# Altium schematic sheet Smartfin Main PCBA Control.SchDoc: Control
size Letter; TOCFontName: Consolas; TOCFontSize: 24; TOCFontColor: 0; TOCFontAttributes: 0; TOCMaxLinesInTable: 25; TOCVerticalOffset: 200; TOCHorizontalOffset: 500; TOCHorizontalSeparation: 800; TOCVerticalSeparation: 30; TOCHorizTableSize: 640; Engineer: Amy Domino; DocumentNumber: 644-001-023; Revision: A; SheetNumber: 3; SheetTotal: 8; PageSetup: Record=PageOptions|CenterHorizontal=True|CenterVertical=True|PrintScale=0.96|XCorrection=1.00|YCorrection=1.00|PrintKind=0|BorderSize=5000000|LeftOffset=0|BottomOffset=0|Orientation=2|PaperLength=1000|PaperWidth=1000|Scale=100|PaperSource=7|PrintQuality=-4|MediaType=1|DitherType=10|PaperKind=11" x 17"|PrintScaleMode=1
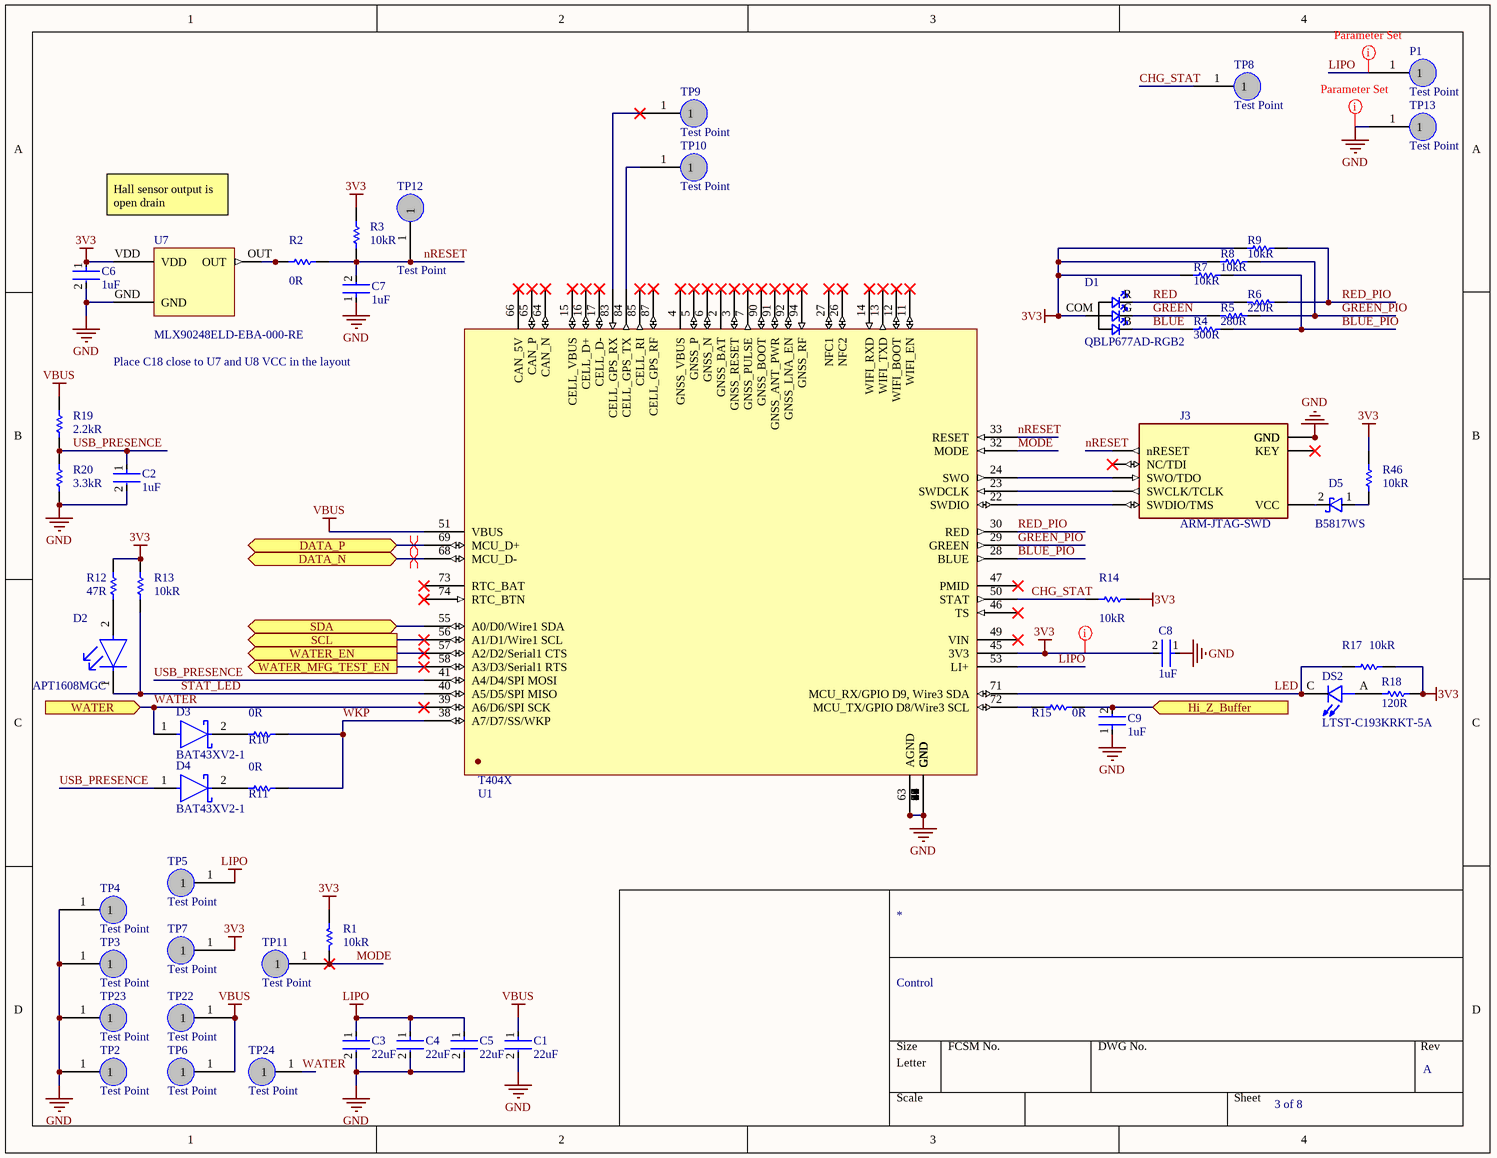
[diagram p0: Smartfin Main PCBA Control.SchDoc]

## Parts
C1  value 22uF  [FP-CC0603-DC-IPC_B]  (hidden comment: CC0603MRX5R5BB226)
C2  value 1uF  [FP-CC0402-IPC_C]  (hidden comment: cc0402krx5r6bb105)
C3  value 22uF  [FP-CC0603-DC-IPC_B]  (hidden comment: CC0603MRX5R5BB226)
C4  value 22uF  [FP-CC0603-DC-IPC_B]  (hidden comment: CC0603MRX5R5BB226)
C5  value 22uF  [FP-CC0603-DC-IPC_B]  (hidden comment: CC0603MRX5R5BB226)
C6  value 1uF  [FP-CC0402-IPC_C]  (hidden comment: cc0402krx5r6bb105)
C7  value 1uF  [FP-CC0402-IPC_C]  (hidden comment: cc0402krx5r6bb105)
C8  value 1uF  [FP-CC0402-IPC_C]  (hidden comment: cc0402krx5r6bb105)
C9  value 1uF  [FP-CC0402-IPC_C]  (hidden comment: cc0402krx5r6bb105)
D1  QBLP677AD-RGB2  [New footprint 1]
D2  APT1608MGC  [SODFL160X75-2N]
D3  BAT43XV2-1  [SODFL250X75-2N]
D4  BAT43XV2-1  [SODFL250X75-2N]
D5  B5817WS  [SODFL250X135-2N]
DS2  LTST-C193KRKT-5A  [LEDC1608X45N]
J3  ARM-JTAG-SWD  [ARM-JTAG-10-SWD-IDC]
P1  Test Point  [New footprint 1]
R1  value 10kR  [RESC1005X04N]  (hidden comment: RC0402FR-0710KL)
R2  value 0R  [RESC1005X04N]  (hidden comment: RC0402JR-070RL)
R3  value 10kR  [RESC1005X04N]  (hidden comment: RC0402FR-0710KL)
R4  value 300R  [RESC1005X04N]  (hidden comment: RC0402FR-07300RL)
R5  value 280R  [RESC1005X04N]  (hidden comment: RC0402FR-07280RL)
R6  value 220R  [RESC1005X04N]  (hidden comment: RC0402FR-07220R)
R7  value 10kR  [RESC1005X04N]  (hidden comment: RC0402FR-0710KL)
R8  value 10kR  [RESC1005X04N]  (hidden comment: RC0402FR-0710KL)
R9  value 10kR  [RESC1005X04N]  (hidden comment: RC0402FR-0710KL)
R10  value 0R  [RESC1005X04N]  (hidden comment: RC0402JR-070RL)
R11  value 0R  [RESC1005X04N]  (hidden comment: RC0402JR-070RL)
R12  47R  [RESC1005X40X25LL05T10]
R13  value 10kR  [RESC1005X04N]  (hidden comment: RC0402FR-0710KL)
R14  value 10kR  [RESC1005X04N]  (hidden comment: RC0402FR-0710KL)
R15  value 0R  [RESC1005X04N]  (hidden comment: RC0402JR-070RL)
R17  value 10kR  [RESC1005X04N]  (hidden comment: RC0402FR-0710KL)
R18  value 120R  [RESC1005X04N]  (hidden comment: RC0402FR-07120RL)
R19  value 2.2kR  [RESC1005X04N]  (hidden comment: RC0402FR-072K2L)
R20  value 3.3kR  [RESC1005X04N]  (hidden comment: RC0402FR-073K3L)
R46  value 10kR  [RESC1005X04N]  (hidden comment: RC0402FR-0710KL)
TP2  Test Point  [New footprint 1]
TP3  Test Point  [New footprint 1]
TP4  Test Point  [New footprint 1]
TP5  Test Point  [New footprint 1]
TP6  Test Point  [New footprint 1]
TP7  Test Point  [New footprint 1]
TP8  Test Point  [New footprint 1]
TP9  Test Point  [New footprint 1]
TP10  Test Point  [New footprint 1]
TP11  Test Point  [New footprint 1]
TP12  Test Point  [New footprint 1]
TP13  Test Point  [New footprint 1]
TP22  Test Point  [New footprint 1]
TP23  Test Point  [New footprint 1]
TP24  Test Point  [New footprint 1]
U1  T404X  [New footprint 1]
U7  MLX90248ELD-EBA-000-RE  [SON50P150X40_HS-7N]

## Ports
DATA_N (bidir), DATA_P (bidir), Hi_Z_Buffer (in), SCL (out), SDA (bidir), WATER (in), WATER_EN (out), WATER_MFG_TEST_EN (out)

## Nets
3V3: C6.1 C8.2 D1.COM R1.2 R3.2 R7.2 R8.2 R9.2 R12.2 R13.2 R14.2 R17.2 R18.2 R46.1 TP7.1 U1.45(3V3) U7.VDD
GND: C1.2 C2.2 C3.2 C4.2 C5.2 C6.2 C7.1 C8.1 C9.1 J3.GND@1(GND) J3.GND@2(GND) J3.GND@3(GND) R20.1 TP2.1 TP3.1 TP4.1 TP13.1 TP23.1 U1.1(GND) U1.8(GND) U1.10(GND) U1.25(GND) U1.31(GND) U1.42(GND) U1.43(GND) U1.48(GND) U1.52(GND) U1.54(GND) U1.63(AGND) U1.67(GND) U1.70(GND) U1.75(GND) U1.86(GND) U1.88(GND) U1.89(GND) U1.93(GND) U1.95(GND) U7.GND
LIPO: C3.1 C4.1 C5.1 P1.1 TP5.1 U1.53(LI+)
VBUS: C1.1 R19.1 TP6.1 TP22.1 U1.51(VBUS)
BLUE: D1.B R4.2
BLUE_PIO: R4.1 R7.1 U1.28(BLUE)
CHG_STAT: R14.1 TP8.1 U1.50(STAT)
DATA_N: U1.68(MCU_D-) ; port DATA_N
DATA_P: U1.69(MCU_D+) ; port DATA_P
GREEN: D1.G R5.2
GREEN_PIO: R5.1 R8.1 U1.29(GREEN)
Hi_Z_Buffer: C9.2 R15.2 ; port Hi_Z_Buffer
LED: DS2.C R17.1 U1.71(MCU_RX/GPIO_D9,_Wire3_SDA)
MODE: R1.1 TP11.1 U1.32(MODE)
nRESET: C7.2 J3.nRESET R2.2 R3.1 TP12.1 U1.33(RESET)
RED: D1.R R6.2
RED_PIO: R6.1 R9.1 U1.30(RED)
SCL: U1.56(A1/D1/Wire1_SCL) ; port SCL
SDA: U1.55(A0/D0/Wire1_SDA) ; port SDA
STAT_LED: D2.1(C) R13.1 U1.40(A5/D5/SPI_MISO)
USB_PRESENCE: C2.1 D4.1(C) R19.2 R20.2 U1.41(A4/D4/SPI_MOSI)
WATER: D3.1(C) TP24.1 U1.39(A6/D6/SPI_SCK) ; port WATER
WATER_EN: U1.57(A2/D2/Serial1_CTS) ; port WATER_EN
WATER_MFG_TEST_EN: U1.58(A3/D3/Serial1_RTS) ; port WATER_MFG_TEST_EN
WKP: R10.2 R11.2 U1.38(A7/D7/SS/WKP)
NetD2_2: D2.2(A) R12.1
NetD3_2: D3.2(A) R10.1
NetD4_2: D4.2(A) R11.1
NetD5_1: D5.1 R46.2
NetD5_2: D5.2 J3.VCC
NetDS2_A: DS2.A R18.1
NetJ3_TCK: J3.TCK(SWCLK/TCLK) U1.23(SWDCLK)
NetJ3_TDO: J3.TDO(SWO/TDO) U1.24(SWO)
NetJ3_TMS: J3.TMS(SWDIO/TMS) U1.22(SWDIO)
NetR2_1: R2.1 U7.OUT
NetR15_1: R15.1 U1.72(MCU_TX/GPIO_D8/Wire3_SCL)
NetTP9_1: TP9.1 U1.83(CELL_GPS_RX)
NetTP10_1: TP10.1 U1.84(CELL_GPS_TX)
NetU1_9: U1.9(NC) U1.18(NC) U1.19(NC) U1.20(NC) U1.21(NC) U1.34(NC) U1.35(NC) U1.36(NC) U1.37(NC) U1.44(NC) U1.59(NC) U1.60(NC) U1.61(NC) U1.62(NC) U1.76(NC) U1.77(NC) U1.78(NC) U1.79(NC) U1.80(NC) U1.81(NC) U1.82(NC)

Not connected (* = marked no-connect by the designer): J3 KEY* TDI(NC/TDI)*; U1 2(GNSS_BAT)* 3(GNSS_RESET)* 4(GNSS_VBUS)* 5(GNSS_P)* 6(GNSS_N)* 7(GNSS_PULSE)* 11(WIFI_EN)* 12(WIFI_BOOT)* 13(WIFI_TXD)* 14(WIFI_RXD)* 15(CELL_VBUS)* 16(CELL_D+)* 17(CELL_D-)* 26(NFC2)* 27(NFC1)* 46(TS)* 47(PMID)* 49(VIN)* 64(CAN_N)* 65(CAN_P)* 66(CAN_5V)* 73(RTC_BAT)* 74(RTC_BTN)* 85(CELL_RI)* 87(CELL_GPS_RF)* 90(GNSS_BOOT)* 91(GNSS_ANT_PWR)* 92(GNSS_LNA_EN)* 94(GNSS_RF)*

## Layout directives
differential pair; rule Signal Stimulus [Kind - Single Pulse    Level - High    Start Time = 0.000    Stop Time = 2.083n    Period Time = 4.167n]: DATA_N, DATA_P
rule Supply Nets [Voltage = 3.700]; net class POWER: LIPO
net class POWER: GND
rule Supply Nets [Voltage = 3.300]; net class POWER: 3V3

## Notes on the sheet
- Hall sensor output is open drain
- Place C18 close to U7 and U8 VCC in the layout

## Library data of the parts
C1 C3-C5 = YAGEO-CC0603MRX5R5BB226-1: Ceramic Capacitor, Multilayer, Ceramic, 6.3V, 20% +Tol, 20% -Tol, X5R, 15% TC, 22uF, Surface Mount, 0603
C2 C6-C9 = YAGEO-CC0402KRX5R6BB105-1: Ceramic Capacitor, Multilayer, Ceramic, 10V, 10% +Tol, 10% -Tol, X5R, 15% TC, 1uF, Surface Mount, 0402
D1 = CMP-006-000001-13: Led Rgb, 3528 PLCC4 Dome Lens, 2; ComponentLink1Description: https://www.digikey.com/en/products/detail/qt-brightek-qtb/QBLP677AD-RGB2/10401015
D2 = CMP-006-000000-5: Single Color LED, Mega Green, Water Clear, 1.2mm
D3 D4 = CMP-004-123445-3: Rectifier Diode, Schottky, 1 Phase, 1 Element, 0.2A, 30V V(RRM), Silicon; Non-rep Pk Forward Current-Max: 4A; Max Power Dissipation: 200mW; Reverse Recovery Time-Max: 0.005us; Forward Voltage: 330mV; Package Body Material: Plastic; Qualification Status: Not Qualified; Number of Elements: 1; Max Output current: 200mA; Reach SVHC Compliant: Yes; JESD-30 Code: R-PDSO-F2; Package Shape: Rectangular; Pins: 2; Technology: SCHOTTKY; Package Style: SMALL OUTLINEMeter; Diode Element Material: SILICON; Terminal Form: Flat; RoHS Compliant: Yes; Moisture Sensitivity Level: 1; Rep Pk Reverse Voltage-Max: 30V; Diode Type: RECTIFIER; Terminal Position: DUAL; Max Operating Temperature: 125°C; Surface Mount: Yes
D5 = CMP-004-000013-6: Rectifier Diode Schottky 20V 1A 2-Pin SOD-323 T/R
DS2 = CMP-004-000003-1: Red 631nm LED Indication - Discrete 2V 0603 (1608 Metric); MF: Lite-On Inc.; Pin Count: 2; SnapEDA_Link: https://www.snapeda.com/parts/LTST-C193KRKT-5A/Lite-On+Inc./view-part/?ref=snap; Value: *; Source: LTST-C193KRKT-5A.SchLib; Package: 0603 Lite-On Inc.; Design Item ID: LTST-C193KRKT-5A; Purchase-URL: https://pricing.snapeda.com/search/part/LTST-C193KRKT-5A/?ref=eda; MP: LTST-C193KRKT-5A; Component Type: Standard; Check_prices: https://www.snapeda.com/parts/LTST-C193KRKT-5A/Lite-On+Inc./view-part/?ref=eda; Digi-Key_Part_Number: 160-1830-2-ND
J3 = CMP-046-000000-2: DEBUG ADAPTER FOR ARM-USB-TINY-H; MF: Olimex LTD; Price: None; Purchase-URL: https://pricing.snapeda.com/search/part/ARM-JTAG-SWD/?ref=eda; Design Item ID: ARM-JTAG-SWD; Availability: In Stock; Component Type: Standard; SnapEDA_Link: https://www.snapeda.com/parts/ARM-JTAG-SWD/Olimex+LTD/view-part/?ref=snap; MP: ARM-JTAG-SWD; Check_prices: https://www.snapeda.com/parts/ARM-JTAG-SWD/Olimex+LTD/view-part/?ref=eda; Package: None; Source: ARM-JTAG-SWD.SchLib; Pin Count: 10; Value: *
P1 TP2-TP13 TP22-TP24 = CMP-00002-11
R1 R3 R7-R9 R13 R14 R17 R46 = CMP-002-000053-2: Fixed Resistor, Metal Glaze/thick Film, 0.0625W, 10000ohm, 50V, 1% +/-Tol, 100ppm/Cel, Surface Mount, 0402
R2 R10 R11 R15 = YAGEO-RC0402JR-070RL-1: Metal Glaze/thick Film, 0.0625W, 0ohm, Surface Mount, 0402
R4 = YAGEO-RC0402FR-07300RL-2: Fixed Resistor, Metal Glaze/thick Film, 0.0625W, 300ohm, 50V, 1% +/-Tol, 100ppm/Cel, Surface Mount, 0402
R5 = YAGEO-RC0402FR-07280RL-2: Fixed Resistor, Metal Glaze/thick Film, 0.0625W, 280ohm, 50V, 1% +/-Tol, 100ppm/Cel, Surface Mount, 0402
R6 = YAGEO-RC0402FR-07220R-2: Fixed Resistor, Metal Glaze/thick Film, 0.0625W, 220ohm, 50V, 1% +/-Tol, 100ppm/Cel, Surface Mount, 0402
R12 = CMP-2002-07703-1: Manufacturer: Yageo / Phycomp; Part Number: RC0402FR-0747RL
R18 = CMP-002-000051-2: Fixed Resistor, Metal Glaze/thick Film, 0.0625W, 120ohm, 50V, 1% +/-Tol, 100ppm/Cel, Surface Mount, 0402
R19 = YAGEO-RC0402FR-072K2L-3: Fixed Resistor, Metal Glaze/thick Film, 0.0625W, 2200ohm, 50V, 1% +/-Tol, 100ppm/Cel, Surface Mount, 0402; Temperature Coefficient: 100ppm/°C; Rated Temperature: 70°C; Package Length: 1mm; Package Height: 0.35mm; Package Width: 0.5mm; Power: 62.5mW; Additional Feature: LASER TRIMMABLE; Termination: Wraparound; Construction: Chip; Min Operating Temperature: -55°C; Max Operating Temperature: 155°C; RoHS Compliant: Yes; Working Voltage: 50V; Terminal Finish: Nickel; JESD-609 Code: e3; Package Shape: Rectangular; Package Style: SMTMeter; Reach SVHC Compliant: Yes; Technology: METAL GLAZE/THICK FILM; Resistor Type: FIXED RESISTOR; Pins: 2; Case/Package: 0402; Packaging: Tape and Reel; Tolerance: 1%; Mounting Technology: Surface Mount
R20 = YAGEO-RC0402FR-073K3L-3: Fixed Resistor, Metal Glaze/thick Film, 0.0625W, 3300ohm, 50V, 1% +/-Tol, 100ppm/Cel, Surface Mount, 0402; Package Height: 0.35mm; Package Width: 0.5mm; Rated Temperature: 70°C; Temperature Coefficient: 100ppm/°C; Additional Feature: LASER TRIMMABLE; Power: 62.5mW; Package Length: 1mm; Package Style: SMTMeter; Terminal Finish: Nickel; Construction: Chip; Min Operating Temperature: -55°C; Case/Package: 0402; Resistor Type: FIXED RESISTOR; Max Operating Temperature: 155°C; Reach SVHC Compliant: Yes; Mounting Technology: Surface Mount; RoHS Compliant: Yes; Technology: METAL GLAZE/THICK FILM; Working Voltage: 50V; Termination: Wraparound; Package Shape: Rectangular; Tolerance: 1%; Pins: 2; JESD-609 Code: e3; Packaging: Tape and Reel
U1 = CMP-002-000045-13: Tracker System on a Module; ComponentLink1URL: https://docs.particle.io/reference/datasheets/tracker/tracker-som-datasheet/
U7 = CMP-002-000033-5: Micropower & Omnipolar Hall Switch; Pin Count: 6; Component Type: Switch; Package: UTQFN-6L